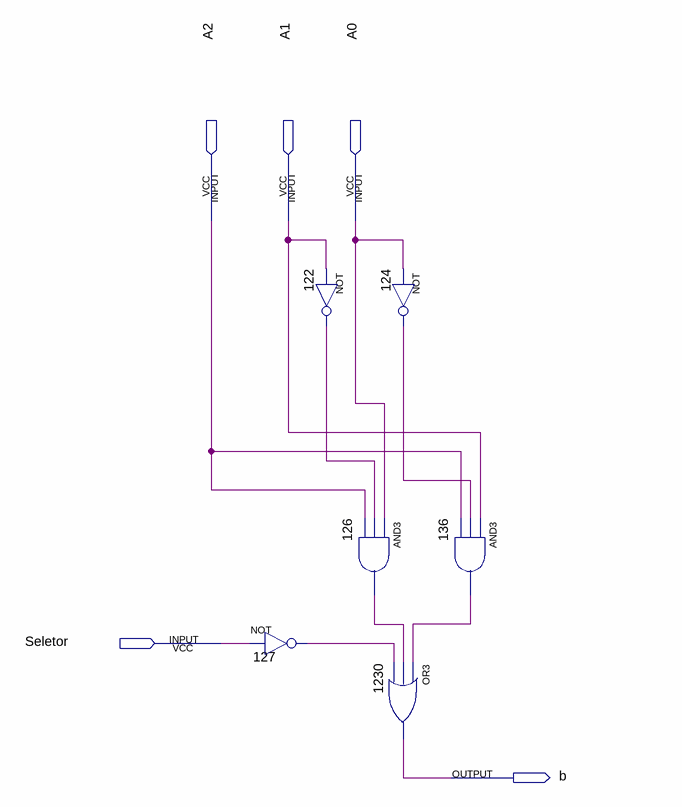
[diagram p0: schematic sheet]
// Quartus schematic segmento_b.bdf as structural Verilog: 6 symbols, 5 pins
module segmento_b (
  input  A2,
  input  A1,
  input  A0,
  input  Seletor,
  output b
);

  wire n122_out, n124_out, n126_out, n127_out, n136_out;

  not u_127 (n127_out, Seletor);
  not u_122 (n122_out, A1);
  not u_124 (n124_out, A0);
  and u_126 (n126_out, A0, n122_out, A2);
  or u_1230 (b, n136_out, n126_out, n127_out);
  and u_136 (n136_out, A1, n124_out, A2);
endmodule
